# Altium schematic sheet A2.SchDoc: Название платы
size 594 x 420 mm; ApprovedBy: Рогов; CheckedBy: Фамилия проверяющего; DrawnBy: Фамилия разработчика; DocumentNumber: Введите номер платы + Э3; SheetNumber: пусто если листов 1, иначе 1; SheetTotal: количество листов; Format: A2; DocumentType: тип схемы; Title1str: (вторая строка при необходимости); ImagePath: Введите номер платы
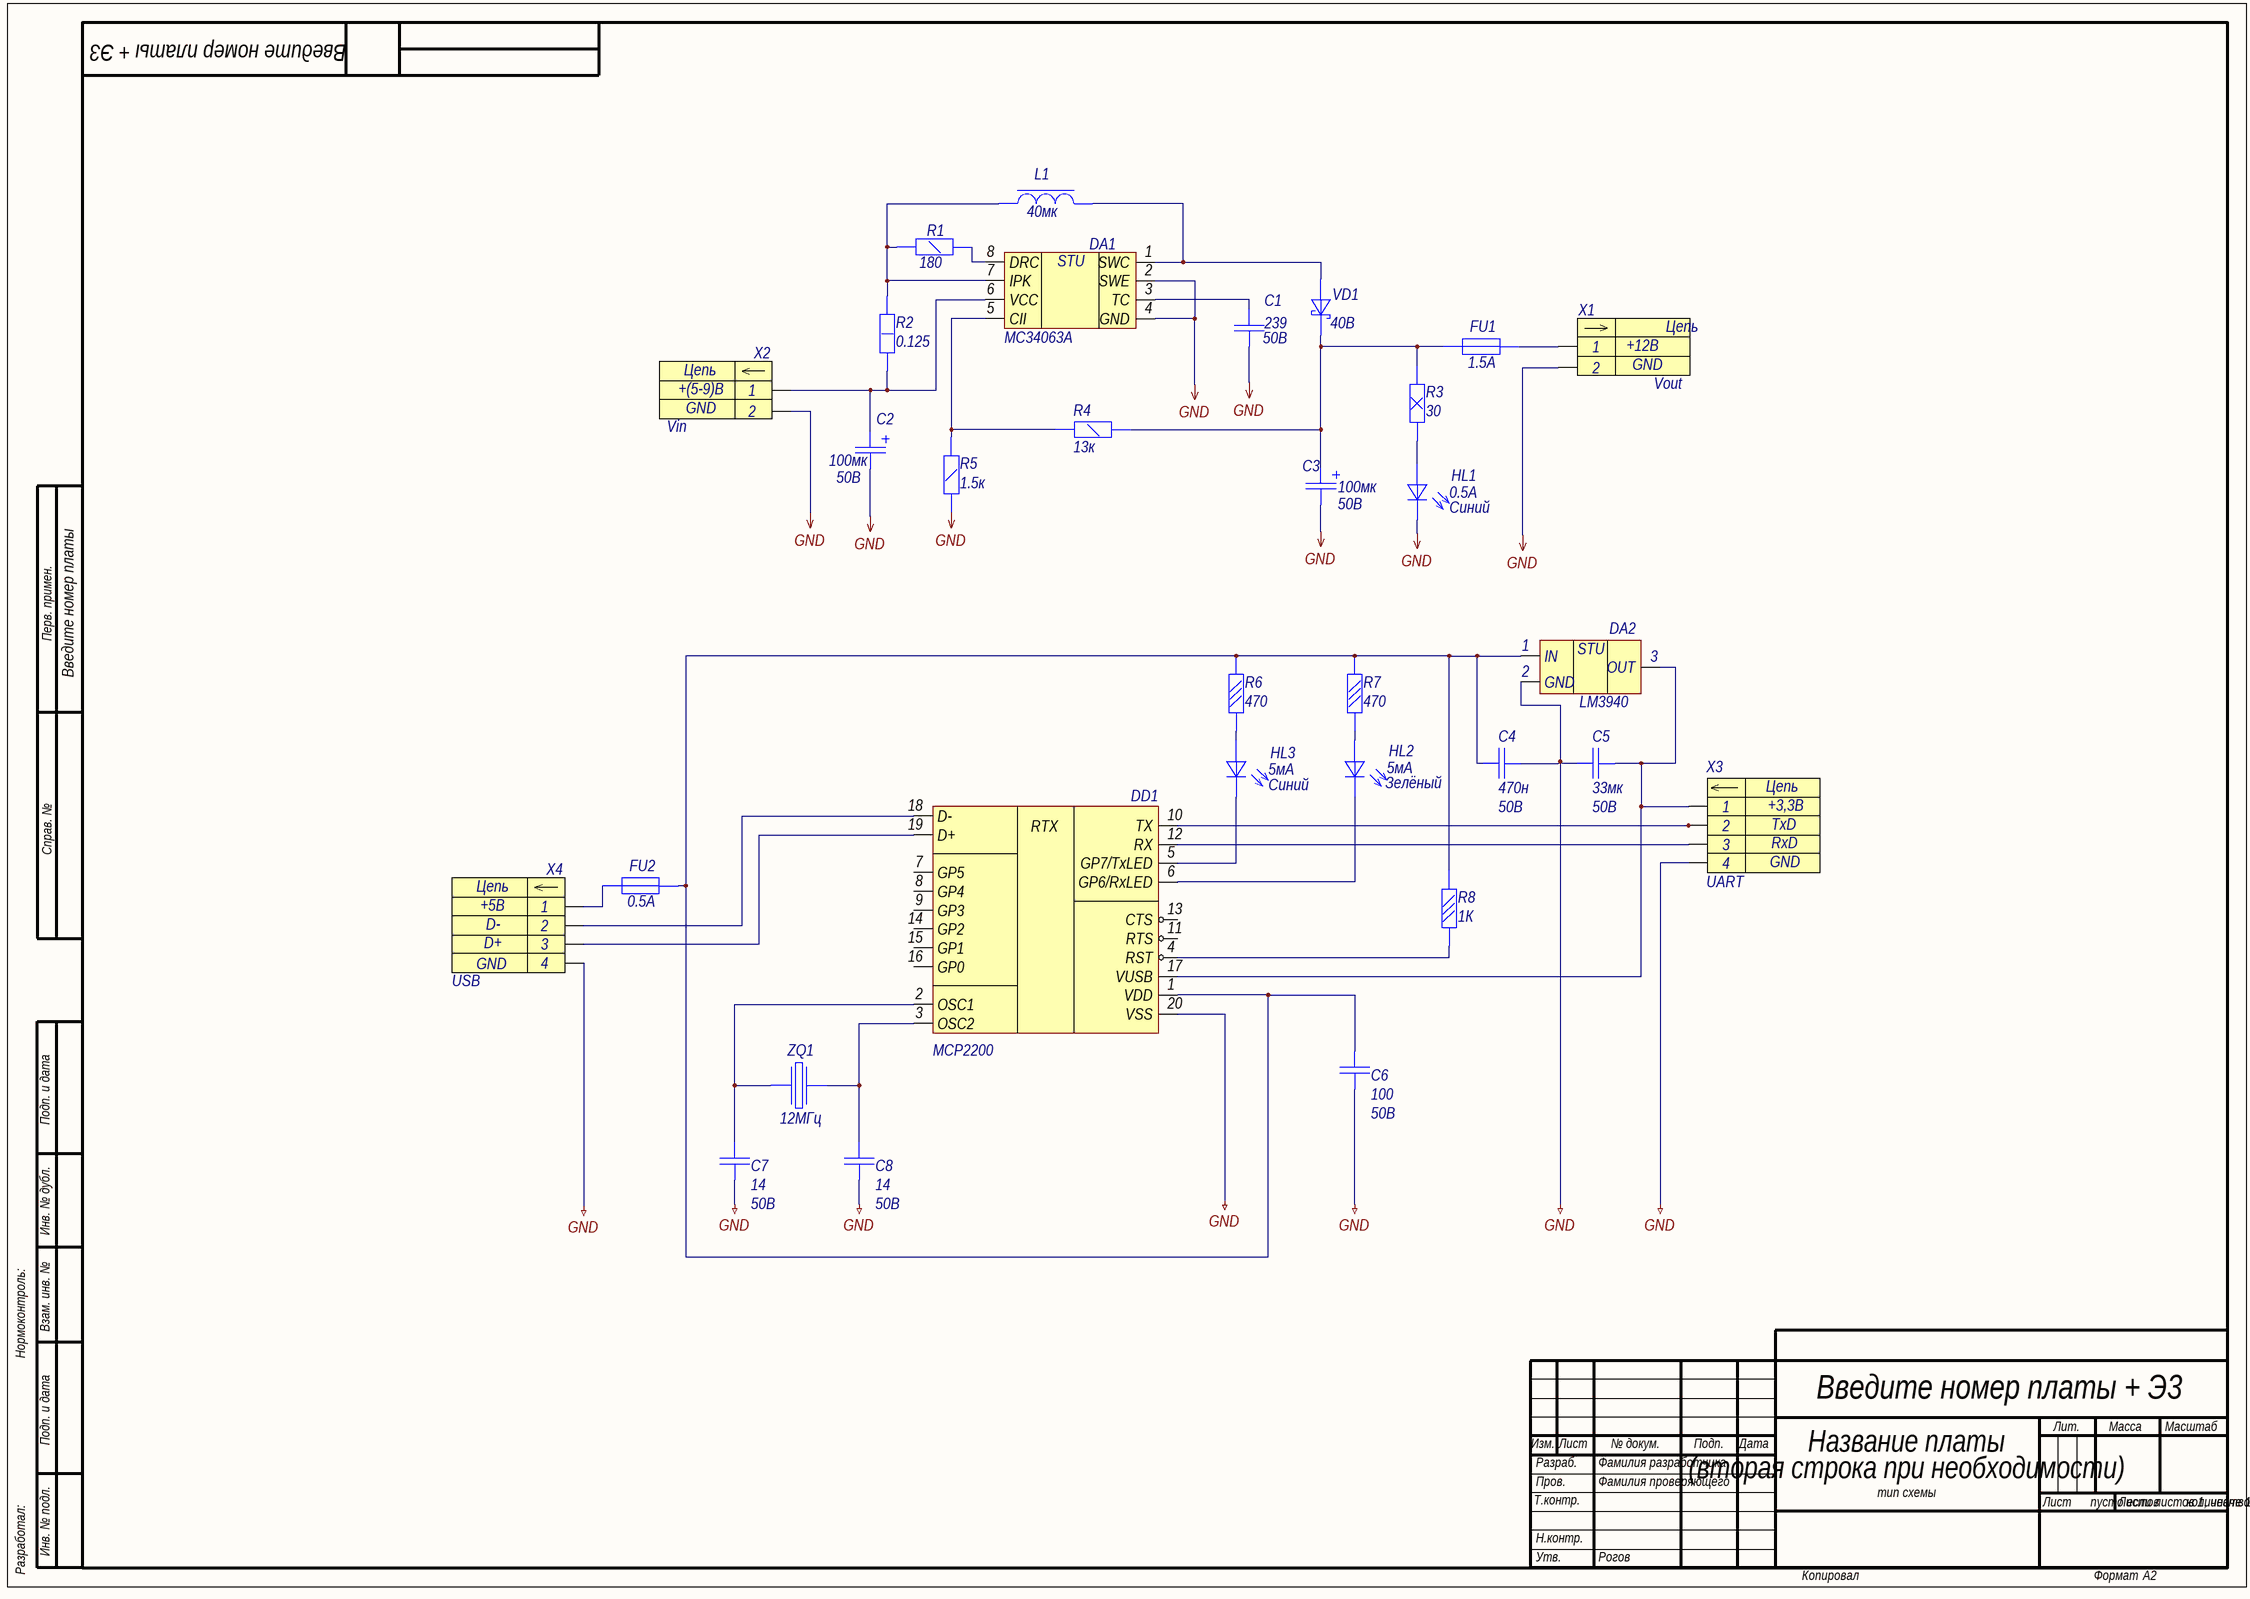
[diagram p0: A2.SchDoc]

## Parts
C1  Ёмкость: 239  Напряжение: 50В  [R0805]  (hidden comment: Capacitor)
C2  Ёмкость: 100мк  Напряжение: 50В  [C1206]  (hidden comment: Capacitor-E)
C3  Ёмкость: 100мк  Напряжение: 50В  [C1206]  (hidden comment: Capacitor-E)
C4  value 470н  Voltage: 50В  [C0805]  (hidden comment: Capacitor)
C5  value 33мк  Voltage: 50В  [C0805]  (hidden comment: Capacitor)
C6  value 100  Voltage: 50В  [C0805]  (hidden comment: Capacitor)
C7  value 14  Voltage: 50В  [C0805]  (hidden comment: Capacitor)
C8  value 14  Voltage: 50В  [C0805]  (hidden comment: Capacitor)
DA1  MC34063A  [PCBComponent_1]
DA2  LM3940  [SOT95P255X145-3N]
DD1  MCP2200  WTF: RTX  [SOIC127P1030X265-20N]
FU1  value 1.5A  [F1812]  (hidden comment: Fuse)
FU2  value 0.5A  [F1812]  (hidden comment: Fuse)
HL1  Прямой ток: 0.5А  Цвет: Синий  [LD0805]  (hidden comment: LED_3V)
HL2  Прямой ток: 5мА  Цвет: Зелёный  [LD0805]  (hidden comment: LED_3V)
HL3  Прямой ток: 5мА  Цвет: Синий  [LD0805]  (hidden comment: LED_3V)
L1  value 40мк  [МДГ-2]  (hidden comment: Coil)
R1  Сопротивление: 180  [R0805]  (hidden comment: Resistor_0,25W)
R2  value 0.125  [R0805]  (hidden comment: Resistor_1,0W)
R3  Сопротивление: 30  [R0805]  (hidden comment: Resistor_10,0W)
R4  value 13к  (hidden comment: Resistor_0,25W)
R5  value 1.5к  [R0805]  (hidden comment: Resistor_0,25W)
R6  Сопротивление: 470  [R0805]  (hidden comment: Resistor_0,05W)
R7  Сопротивление: 470  [R0805]  (hidden comment: Resistor_0,05W)
R8  value 1К  [R0805]  (hidden comment: Resistor_0,05W)
VD1  Максимальное обратное напряжение: 40В  [DO-214AC]  (hidden comment: Schottky)
X1  Vout  U: +12В  [CWF-2]
X2  Vin  U: +(5-9)В  [WF-2]
X3  UART  In: TxD  Out: RxD  U: +3,3В  [UART]
X4  USB  U: +5В  Out: D-  In: D+  [USB]
ZQ1  Частота: 12МГц  [HC-49S]  (hidden comment: Crystal)

## Nets
GND: C1.1 C2.2 C3.2 C4.1 C5.2 C6.2 C7.1 C8.1 DA1.2(SWE) DA1.4(GND) DA2.2(GND) DD1.20(VSS) HL1.2(К) R5.1 X1.2 X2.2 X3.4 X4.4
NetC1_2: C1.2 DA1.3(TC)
NetC2_1: C2.1 DA1.6(VCC) R2.1 X2.1
NetC3_1: C3.1 FU1.2 R3.2 R4.2 VD1.2(К)
NetC4_2: C4.2 C6.1 DA2.1(IN) DD1.1(VDD) FU2.1 R6.2 R7.2 R8.2
NetC5_1: C5.1 DA2.3(OUT) DD1.17(VUSB) X3.1
NetC7_2: C7.2 DD1.2(OSC1) ZQ1.1
NetC8_2: C8.2 DD1.3(OSC2) ZQ1.3
NetDA1_1: DA1.1(SWC) L1.2 VD1.1(А)
NetDA1_5: DA1.5(CII) R4.1 R5.2
NetDA1_7: DA1.7(IPK) L1.1 R1.1 R2.2
NetDA1_8: DA1.8(DRC) R1.2
NetDD1_4: DD1.4(RST) R8.1
NetDD1_5: DD1.5(GP7/TxLED) HL3.2(К)
NetDD1_6: DD1.6(GP6/RxLED) HL2.2(К)
NetDD1_10: DD1.10(TX) X3.2
NetDD1_12: DD1.12(RX) X3.3
NetDD1_18: DD1.18(D-) X4.2
NetDD1_19: DD1.19(D+) X4.3
NetFU1_1: FU1.1 X1.1
NetFU2_2: FU2.2 X4.1
NetHL1_1: HL1.1(А) R3.1
NetHL2_1: HL2.1(А) R7.1
NetHL3_1: HL3.1(А) R6.1

Not connected (* = marked no-connect by the designer): DD1 7(GP5) 8(GP4) 9(GP3) 11(RTS) 13(CTS) 14(GP2) 15(GP1) 16(GP0)

## Notes on the sheet
- Перв. примен.
- (near C5) +
- Справ. №
- Подп. и дата
- Инв. № дубл.
- Нормоконтроль:
- Взам. инв. №
- Изм.
- Лист
- № докум.
- Подп.
- Дата
- Лит.
- Масса
- Масштаб
- Т.контр.
- Пров.
- Разраб.
- Листов
- Разработал:
- Инв. № подл.
- Н.контр.
- Утв.
- Копировал
- Формат
- (in symbol LM3940) STU
- (in symbol MC34063A) STU
- (in symbol UART) Цепь
- (in symbol USB) Цепь
- (in symbol Vin) Цепь
- (in symbol Vout) Цепь

## Library data of the parts
C1 C4-C8 = Capacitor: Type: Конденсатор
  C1: Published: 18.05.2010; Publisher: Andrew Danich
C2 C3 = Capacitor-E: Type: Конденсатор; Published: 20.08.2010; Publisher: Олег Литвинов
DD1 = MCP2200: Create: Litvinov
HL1 = Led-1: Type: Индикатор единичный; Прямое напряжение: 3.3В; Произв. номер: SMLE13EC8TT86; Published: 03.12.2013; Publisher: Andrew Danich
HL2 HL3 = Led-1: Type: Индикатор единичный; Прямое напряжение: 3В; Произв. номер: SMLE13EC8TT86; Published: 03.12.2013; Publisher: Andrew Danich
L1 = КИВ18-100: Manufacturer: ОАО "МСТАТОР"; Type: Дроссель; ID: 1; Rated Current: 185mA; Tolerance: ±10%; Q: 20; DC Resistance: 1.2ohm; Specification: КВШУ.670114.001 ТУ; Application Category: 5; Working Temperature Min: -60°С; Working Temperature Max: +85°С; Published: 20.05.2010; Publisher: Andrew Danich; Part Number: КИВ18-100; Footprint: 0603
VD1 = Schottky: BYV10-40; Type: Диод; Прямой ток: 1 А
X1 = Vout: Create: DeathSpeaker; GND: GND
X2 = Vin: Create: DeathSpeaker; Out: D-; In: D+; GND: GND
X3 = UART: Create: Litvinov; GND: GND
X4 = USB: Create: Litvinov; GND: GND
DA2 = LM3940: Item ID: LM3940
FU1 FU2 = Fuse: Type: Вставка плавкая
R1 R4 R5 = Resistor_0,25W: Type: Резистор
R2 = Resistor_1,0W: Type: Резистор
R3 = Resistor_10,0W: Type: Резистор
R6-R8 = Resistor_0,05W: Type: Резистор
ZQ1 = Crystal: Published: 08.03.2013; Publisher: Andrew Danich; Type: Резонатор